# EAGLE design comando (EAGLE 6.5.0)
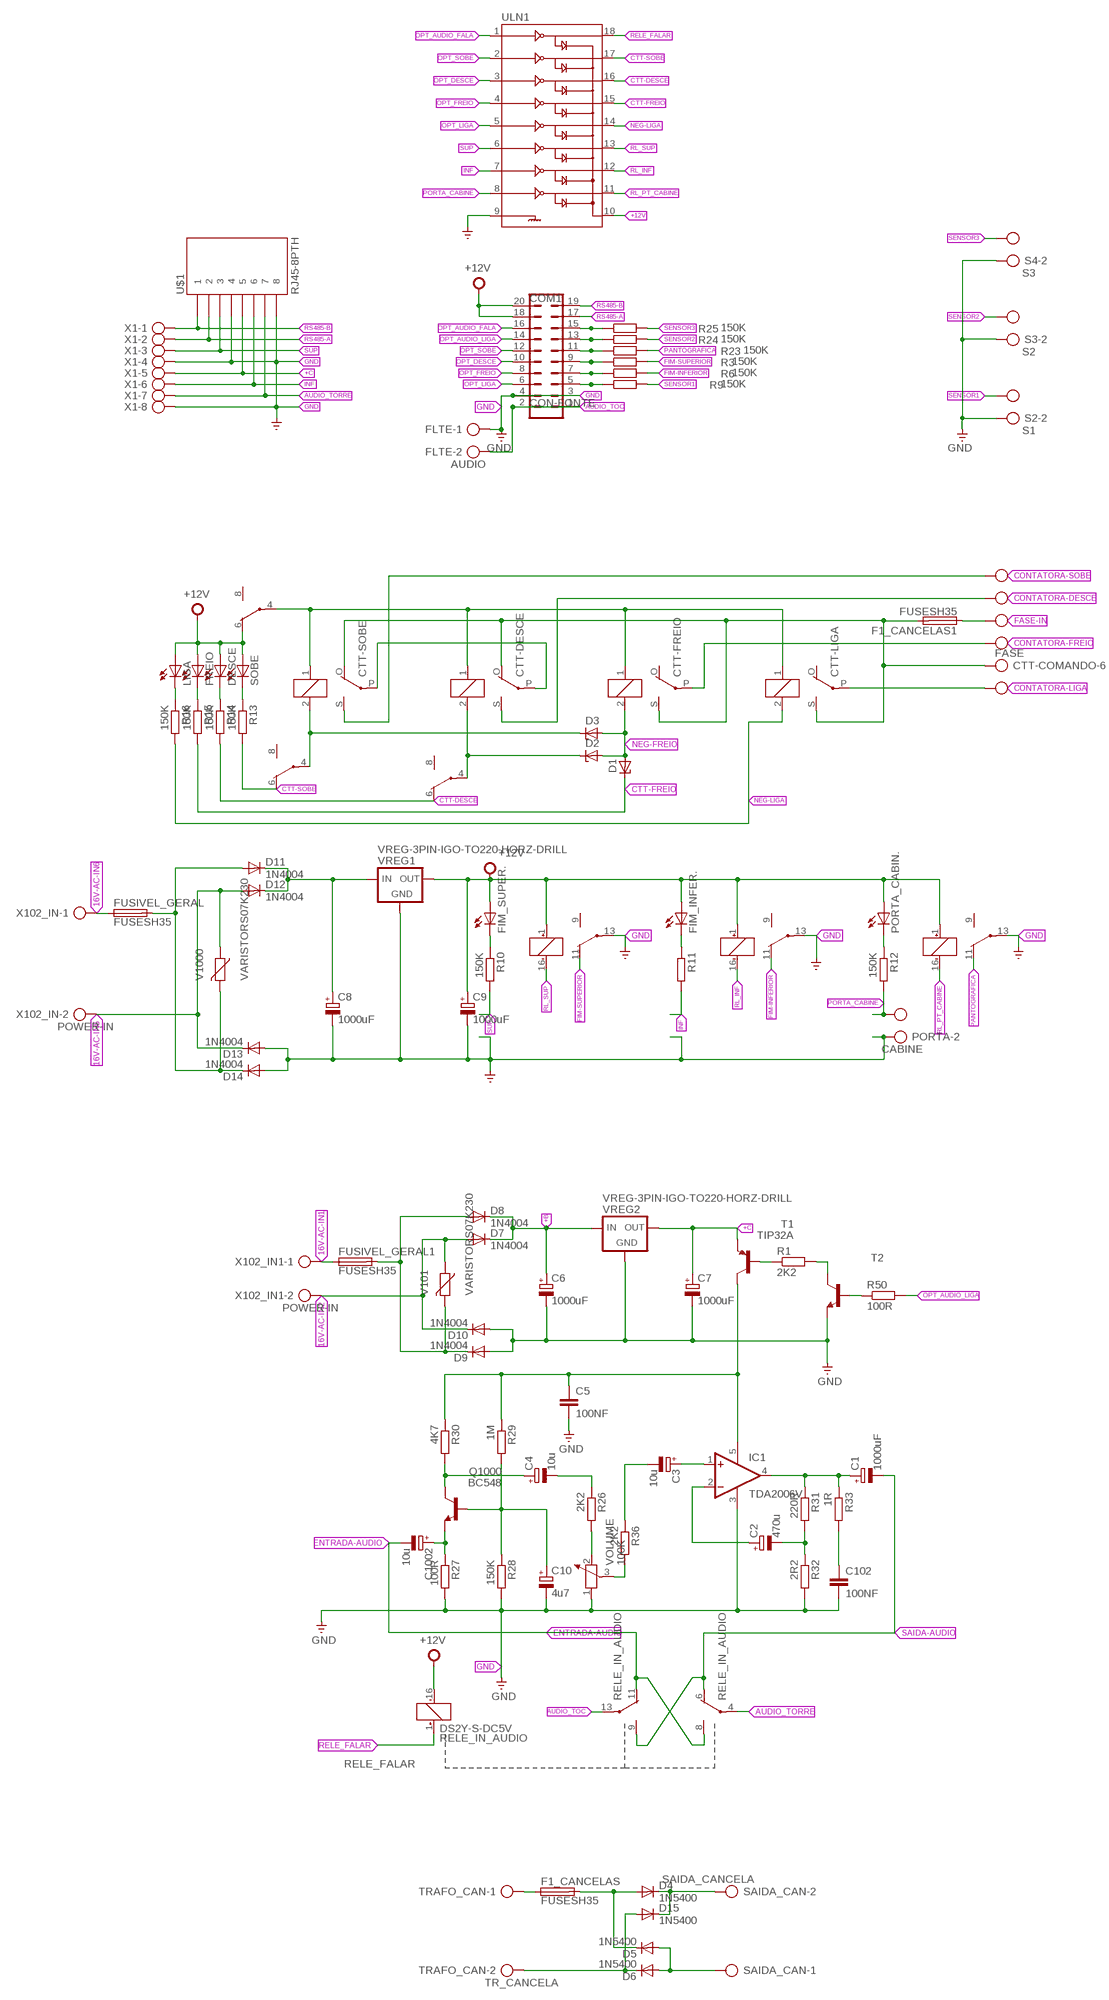
[diagram p0: schematic, sheet 1]

## Parts
C1  1000uF  CPOL-EUTAP5-80  [TAP5-80]
C2  470u  CPOL-EUTAP5-80  [TAP5-80]
C3  10u  CPOL-EUTAP5-45  [TAP5-45]
C4  10u  CPOL-EUTAP5-45  [TAP5-45]
C5  100NF  C-EU050-030X075  [C050-030X075]
C6  1000uF  CPOL-EUTAP5-80  [TAP5-80]
C7  1000uF  CPOL-EUTAP5-80  [TAP5-80]
C8  1000uF  CPOL-EUTAP5-80  [TAP5-80]
C9  1000uF  CPOL-EUTAP5-80  [TAP5-80]
C10  4u7  CPOL-EUTAP5-45  [TAP5-45]
C102  100NF  C-EU050-030X075  [C050-030X075]
C1002  10u  CPOL-EUTAP5-45  [TAP5-45]
COM1  CON-FONTE  ML20  [ML20]
CTT-COMANDO  FASE  AK500/6  [AK500/6]
CTT-DESCE  G5L  [G5LE]
CTT-FREIO  G5L  [G5LE]
CTT-LIGA  G5L  [G5LE]
CTT-SOBE  G5L  [G5LE]
D1  ZENER-DIODEZD-7.5  [ZDIO-7.5]
D2  ZENER-DIODEZD-7.5  [ZDIO-7.5]
D3  ZENER-DIODEZD-7.5  [ZDIO-7.5]
D4  1N5400  [DO201-15]
D5  1N5400  [DO201-15]
D6  1N5400  [DO201-15]
D7  1N4004  [DO41-10]
D8  1N4004  [DO41-10]
D9  1N4004  [DO41-10]
D10  1N4004  [DO41-10]
D11  1N4004  [DO41-10]
D12  1N4004  [DO41-10]
D13  1N4004  [DO41-10]
D14  1N4004  [DO41-10]
D15  1N5400  [DO201-15]
DESCE  LED5MM  [LED5MM]
F1_CANCELAS  FUSESH35  [SH25]
F1_CANCELAS1  FUSESH35  [SH25]
FIM_INFER.  LED5MM  [LED5MM]
FIM_SUPER.  LED5MM  [LED5MM]
FLTE  AUDIO  AK500/2  [AK500/2]
FREIO  LED5MM  [LED5MM]
FUSIVEL_GERAL  FUSESH35  [SH25]
FUSIVEL_GERAL1  FUSESH35  [SH25]
IC1  TDA2006V  [CB360]
LIGA  LED5MM  [LED5MM]
PORTA  CABINE  AK500/2  [AK500/2]
PORTA_CABIN.  LED5MM  [LED5MM]
PORTA_CABINE  DS2Y-S-DC5V  [DS2Y]
Q1000  BC548  [TO92-EBC]
R1  2K2  R-EU_0207/10  [0207/10]
R3  150K  R-EU_0207/10  [0207/10]
R6  150K  R-EU_0207/10  [0207/10]
R9  150K  R-EU_0207/10  [0207/10]
R10  150K  R-EU_0207/10  [0207/10]
R11  150K  R-EU_0207/10  [0207/10]
R12  150K  R-EU_0207/10  [0207/10]
R13  150K  R-EU_0207/10  [0207/10]
R14  150K  R-EU_0207/10  [0207/10]
R15  150K  R-EU_0207/10  [0207/10]
R16  150K  R-EU_0207/10  [0207/10]
R23  150K  R-EU_0207/10  [0207/10]
R24  150K  R-EU_0207/10  [0207/10]
R25  150K  R-EU_0207/10  [0207/10]
R26  2K2  R-EU_0207/10  [0207/10]
R27  100R  R-EU_0207/10  [0207/10]
R28  150K  R-EU_0207/10  [0207/10]
R29  1M  R-EU_0207/10  [0207/10]
R30  4K7  R-EU_0207/10  [0207/10]
R31  220R  R-EU_0207/10  [0207/10]
R32  2R2  R-EU_0207/10  [0207/10]
R33  1R  R-EU_0207/10  [0207/10]
R36  2K2  R-EU_0207/10  [0207/10]
R50  100R  R-EU_0207/10  [0207/10]
RELE_IN_AUDIO  DS2Y-S-DC5V  [DS2Y]
RL_FIM_INFERIOR  DS2Y-S-DC5V  [DS2Y]
RL_FIM_SUPERIOR  DS2Y-S-DC5V  [DS2Y]
S2  S1  AK500/2  [AK500/2]
S3  S2  AK500/2  [AK500/2]
S4  S3  AK500/2  [AK500/2]
SAIDA_CAN  SAIDA_CANCELA  AK500/2  [AK500/2]
SOBE  LED5MM  [LED5MM]
T1  TIP32A  [TO220]
T2  BC548-NPN-TO92-CBE  [TO92-CBE]
TRAFO_CAN  TR_CANCELA  AK500/2  [AK500/2]
U$1  RJ45-8PTH  [RJ45-8]
ULN1  ULN2803DIP  [DIL18]
V101  VARISTORS07K230  [S07K230]
V1000  VARISTORS07K230  [S07K230]
VOLUME  100K  POTENTIOMETER_PT-10  [PT-10]
VREG1  VREG-3PIN-IGO-TO220-HORZ-DRILL  [TO220-HORZ-DRILL]
VREG2  VREG-3PIN-IGO-TO220-HORZ-DRILL  [TO220-HORZ-DRILL]
X1  RS485_CNT  AK500/8  [AK500/8]
X102_IN  POWER-IN  AK500/2  [AK500/2]
X102_IN1  POWER-IN  AK500/2  [AK500/2]

## Nets
16V-AC-IN1 [power]: FUSIVEL_GERAL1.1 X102_IN1.1
16V-AC-IN2 [power]: D7.A D10.C V101.1 X102_IN1.2
16V-AC-IN5 [power]: D12.A D13.C V1000.1 X102_IN.2
16V-AC-IN6 [power]: FUSIVEL_GERAL.1 X102_IN.1
+12V [power]: C9.+ COM1.18 COM1.20 DESCE.A FIM_INFER..A FIM_SUPER..A FREIO.A LIGA.A PORTA_CABIN..A PORTA_CABINE.1(1:+) PORTA_CABINE.6(2:O) RELE_IN_AUDIO.16(1:-) RL_FIM_INFERIOR.1(1:+) RL_FIM_SUPERIOR.1(1:+) SOBE.A ULN1.10 VREG1.3(OUT)
+B [power]: C6.+ D7.C D8.C VREG2.1(IN)
+C [power]: C7.+ T1.3(E) U$1.5 VREG2.3(OUT) X1.5
AC-ALIM [AC]: CTT-COMANDO.6 CTT-DESCE.O(2:O) CTT-FREIO.S(2:S) CTT-LIGA.S(2:S) CTT-SOBE.O(2:O) F1_CANCELAS1.2
AUDIO_TOC [power]: COM1.1 COM1.2 FLTE.2 RELE_IN_AUDIO.13(3:P)
AUDIO_TORRE [power]: RELE_IN_AUDIO.4(2:P) U$1.7 X1.7
CONTATORA-DESCE [AC]: CTT-COMANDO.4 CTT-DESCE.S(2:S)
CONTATORA-FREIO [AC]: CTT-COMANDO.3 CTT-FREIO.P(2:P)
CONTATORA-LIGA [AC]: CTT-COMANDO.2 CTT-LIGA.P(2:P)
CONTATORA-SOBE [AC]: CTT-COMANDO.5 CTT-SOBE.S(2:S)
CTT-DESCE: R14.2 RL_FIM_INFERIOR.6(2:O) ULN1.16
CTT-FREIO: D1.C R15.2 ULN1.15
CTT-SOBE: R13.2 RL_FIM_SUPERIOR.6(2:O) ULN1.17
ENTRADA-AUDIO: C1002.- RELE_IN_AUDIO.8(2:S) RELE_IN_AUDIO.11(3:O)
FASE-IN [AC]: CTT-COMANDO.1 F1_CANCELAS1.1
FIM-INFERIOR: R6.2 RL_FIM_INFERIOR.11(3:O)
FIM-SUPERIOR: R3.2 RL_FIM_SUPERIOR.11(3:O)
GND [power]: C5.2 C6.- C7.- C8.- C9.- C10.- C102.2 COM1.3 COM1.4 D9.A D10.A D13.A D14.A FLTE.1 IC1.3(V-) PORTA.2 PORTA_CABINE.13(3:P) R27.2 R28.2 R32.2 RL_FIM_INFERIOR.13(3:P) RL_FIM_SUPERIOR.13(3:P) S2.2 S3.2 S4.2 T2.E U$1.4 U$1.8 ULN1.9 VOLUME.1 VREG1.2(GND) VREG2.2(GND) X1.4 X1.8
INF: R11.2 U$1.6 ULN1.7 X1.6
N$1 [AC]: D4.C D15.C SAIDA_CAN.2
N$2 [AC]: D4.A D5.C F1_CANCELAS.2
N$3 [AC]: D6.C D15.A TRAFO_CAN.2
N$4 [AC]: D5.A D6.A SAIDA_CAN.1
N$5 [power]: CTT-DESCE.1 CTT-FREIO.1 CTT-LIGA.1 CTT-SOBE.1 PORTA_CABINE.4(2:P)
N$6: R36.2 VOLUME.3
N$7 [power]: C8.+ D11.C D12.C VREG1.1(IN)
N$10: FIM_SUPER..K(C) R10.1
N$11: R26.2 VOLUME.2
N$19: FIM_INFER..K(C) R11.1
N$21: R1.1 T1.1(B)
N$24: PORTA_CABIN..K(C) R12.1
N$28: R13.1 SOBE.K(C)
N$29: DESCE.K(C) R14.1
N$32: FREIO.K(C) R15.1
N$33: LIGA.K(C) R16.1
N$39: R50.1 T2.B
N$78 [AC]: F1_CANCELAS.1 TRAFO_CAN.1
N$79 [power]: C1.+ IC1.4(OUT) R31.1 R33.1
N$80: C4.- R26.1
N$89: C4.+ Q1000.C R30.2
N$90: C10.+ Q1000.B R28.1 R29.2
N$92: C1002.+ Q1000.E R27.1
N$94: C3.- R36.1
N$104 [power]: C5.1 IC1.5(V+) R29.1 R30.1 T1.2(C)
N$105: C3.+ IC1.1(+IN)
N$106 [power]: C2.- R31.2 R32.1
N$119 [power]: C2.+ IC1.2(-IN)
N$120: C102.1 R33.2
NEG-DESCE: CTT-DESCE.2 D2.C RL_FIM_INFERIOR.4(2:P)
NEG-FREIO: CTT-FREIO.2 D1.A D2.A D3.A
NEG-LIGA: CTT-LIGA.2 R16.2 ULN1.14
NEG-SOB: CTT-SOBE.2 D3.C RL_FIM_SUPERIOR.4(2:P)
OPT_AUDIO_FALA: COM1.16 ULN1.1
OPT_AUDIO_LIGA: COM1.14 R50.2
OPT_DESCE: COM1.10 ULN1.3
OPT_FIM_INFERIOR: COM1.7 R6.1
OPT_FIM_SUPERIOR: COM1.9 R3.1
OPT_FREIO: COM1.8 ULN1.4
OPT_LIGA: COM1.6 ULN1.5
OPT_PANTOGRAFICA: COM1.11 R23.1
OPT_SENSOR1: COM1.5 R9.1
OPT_SENSOR2: COM1.13 R24.1
OPT_SENSOR3: COM1.15 R25.1
OPT_SOBE: COM1.12 ULN1.2
PANTOGRAFICA: PORTA_CABINE.11(3:O) R23.2
PORTA_CABINE: PORTA.1 R12.2 ULN1.8
RELE_FALAR: RELE_IN_AUDIO.1(1:+) ULN1.18
RELE_LIGA_AUDIO: R1.2 T2.C
RL_INF: RL_FIM_INFERIOR.16(1:-) ULN1.12
RL_PT_CABINE: PORTA_CABINE.16(1:-) ULN1.11
RL_SUP: RL_FIM_SUPERIOR.16(1:-) ULN1.13
RS485-A: COM1.17 U$1.2 X1.2
RS485-B: COM1.19 U$1.1 X1.1
SAIDA-AUDIO [power]: C1.- RELE_IN_AUDIO.6(2:O) RELE_IN_AUDIO.9(3:S)
SAIDA_FUSIVEL [power]: D11.A D14.C FUSIVEL_GERAL.2 V1000.2
SAIDA_FUSIVEL1 [power]: D8.A D9.C FUSIVEL_GERAL1.2 V101.2
SENSOR1: R9.2 S2.1
SENSOR2: R24.2 S3.1
SENSOR3: R25.2 S4.1
SOB-DESC-PROT [AC]: CTT-DESCE.P(2:P) CTT-SOBE.P(2:P)
SUP: R10.2 U$1.3 ULN1.6 X1.3
Unconnected: CTT-FREIO.O(2:O) CTT-LIGA.O(2:O) PORTA_CABINE.8(2:S) PORTA_CABINE.9(3:S) RL_FIM_INFERIOR.8(2:S) RL_FIM_INFERIOR.9(3:S) RL_FIM_SUPERIOR.8(2:S) RL_FIM_SUPERIOR.9(3:S)

## Library data of the parts
C1-C4 C6-C10 C1002 = rcl:CPOL-EU: POLARIZED CAPACITOR, European symbol
C5 C102 = rcl:C-EU: CAPACITOR, European symbol
COM1 = con-ml:ML20: HARTING; OC_FARNELL: unknown; OC_NEWARK: unknown
CTT-COMANDO = con-ptr500:AK500/6: CONNECTOR; OC_FARNELL: unknown; OC_NEWARK: unknown
CTT-DESCE CTT-FREIO CTT-LIGA CTT-SOBE = relay:G5L: RELAY 1 x switch, 10 A/120 V AC, 8 A/30 V ADC, Omron; OC_FARNELL: unknown; OC_NEWARK: unknown
D1-D3 = diode:ZENER-DIODE: Z-Diode
D4-D6 D15 = diode:1N5400: DIODE standard rectifier, 3 A, 50 V (Motorola)
D7-D14 = diode:1N4004: DIODE general purpose rectifier, 1 A
DESCE FIM_INFER. FIM_SUPER. FREIO LIGA PORTA_CABIN. SOBE = led:LED: LED OSRAM: - CHIPLED LG R971, LG N971, LY N971, LG Q971, LY Q971, LO R971, LY R971 LH N974, LH R974 LS Q976, LO Q976, LY Q976 LO Q996 - Hyper CHIPLED LW Q18S LB Q993, LB Q99A, LB R99A - SideLED LS A670, LO A670, LY A670, LG A670, LP A670 LB A673, LV A673, LT A673, LW A673 LH A674 LY A675 LS A676, LA A676, LO A676, LY A676, LW A676 LS A679, LY A679, LG A679 - Hyper Micro SIDELED® LS Y876, LA Y876, LO Y876, LY Y876 LT Y87S - SmartLED LW L88C, LW L88S LB L89C, LB L89S, LG L890 LS L89K, LO L89K, LY L89K LS L896, LA L896, LO L896, LY L896 - TOPLED LS T670, LO T670, LY T670, LG T670, LP T670 LSG T670, LSP T670, LSY T670, LOP T670, LYG T670 LG T671, LOG T671, LSG T671 LB T673, LV T673, LT T673, LW T673 LH T674 LS T676, LA T676, LO T676, LY T676, LB T676, LH T676, LSB T676, LW T676 LB T67C, LV T67C, LT T67C, LS T67K, LO T67K, LY T67K, LW E67C LS E67B, LA E67B, LO E67B, LY E67B, LB E67C, LV E67C, LT E67C LW T67C LS T679, LY T679, LG T679 LS T770, LO T770, LY T770, LG T770, LP T770 LB T773, LV T773, LT T773, LW T773 LH T774 LS E675, LA E675, LY E675, LS T675 LS T776, LA T776, LO T776, LY T776, LB T776 LHGB T686 LT T68C, LB T68C - Hyper Mini TOPLED® LB M676 - Mini TOPLED Santana® LG M470 LS M47K, LO M47K, LY M47K Source: http://www.osram.convergy.de LUXEON: - LUMILED® LXK2-PW12-R00, LXK2-PW12-S00, LXK2-PW14-U00, LXK2-PW14-V00 LXK2-PM12-R00, LXK2-PM12-S00, LXK2-PM14-U00 LXK2-PE12-Q00, LXK2-PE12-R00, LXK2-PE12-S00, LXK2-PE14-T00, LXK2-PE14-U00 LXK2-PB12-K00, LXK2-PB12-L00, LXK2-PB12-M00, LXK2-PB14-N00, LXK2-PB14-P00, LXK2-PB14-Q00 LXK2-PR12-L00, LXK2-PR12-M00, LXK2-PR14-Q00, LXK2-PR14-R00 LXK2-PD12-Q00, LXK2-PD12-R00, LXK2-PD12-S00 LXK2-PH12-R00, LXK2-PH12-S00 LXK2-PL12-P00, LXK2-PL12-Q00, LXK2-PL12-R00 Source: www.luxeon.com KINGBRIGHT: KA-3528ASYC Source: www.kingbright.com
F1_CANCELAS F1_CANCELAS1 FUSIVEL_GERAL FUSIVEL_GERAL1 = fuse:FUSE: Fuse; OC_FARNELL: unknown; OC_NEWARK: unknown
FLTE PORTA S2-S4 SAIDA_CAN TRAFO_CAN X102_IN X102_IN1 = con-ptr500:AK500/2: CONNECTOR; OC_FARNELL: unknown; OC_NEWARK: unknown
IC1 = linear:TDA2006: AUDIO AMPLIFIER
PORTA_CABINE RELE_IN_AUDIO RL_FIM_INFERIOR RL_FIM_SUPERIOR = relay:DS2Y-S-DC*: MINIATURE RELAY NAiS Source: http://www.mew-europe.com/.. en_ds_61005_0023.pdf; MPN: DS2Y-S-DC5V; OC_FARNELL: unknown; OC_NEWARK: 13P3268
Q1000 = transistor-npn:BC548*: NPN Transistor
R1 R3 R6 R9-R16 R23-R33 R36 R50 = rcl:R-EU_: RESISTOR, European symbol
T1 = transistor:TIP32: PNP Transistor Medium Power Linear Switching Applications Source: http://onsemi.com
T2 = transistor:*-NPN-: NPN Transistror BF959 corrected 2008.03.06
U$1 = SparkFun-Connectors:RJ45-8: RJ45 Jack Simple RJ45, 8-pin connection - connector for common Cat5, Cat5e, and Cat6 Ethernet cables. Footprint not yet proven in production. Connector sku is PRT-00643; Breakout PCB sku is BOB-00716.
ULN1 = SparkFun:ULN2803: Darlington Driver ULN2803 Darlington array. 500mA max per channel, 8-channel package. Spark Fun Electronics SKU : COM-00312
V101 V1000 = varistor:VARISTOR: VARISTOR
VOLUME = rcl:POTENTIOMETER_: Potentiometer
VREG1 VREG2 = tidyeagle:VREG-3PIN: Generic 3 Pin Voltage Regulator For voltage regulators such as the LM7805 and similar. Horizontal TO220 packages are available with and without drill holes for mounting. Important: Note the pin connection and check against your datasheet. Pin 1 is the left most pin when looking down from the top of the package, as shown in the diagram on the right hand side. IGO (e.g. LM7805) Pin 1 - Input Pin 2 - GND Pin 3 - Output GOI (e.g. LD1086V33) Pin 1 - GND Pin 2 - Output Pin 3 - Input
X1 = con-ptr500:AK500/8: CONNECTOR; OC_FARNELL: unknown; OC_NEWARK: unknown

## Net classes
0 default: drill 0.203 mm, clearance 0.203 mm
1 AC: width 2.032 mm, drill 0.203 mm, clearance 0.203 mm
2 power: width 0.762 mm, drill 0.203 mm, clearance 0.203 mm

## Board
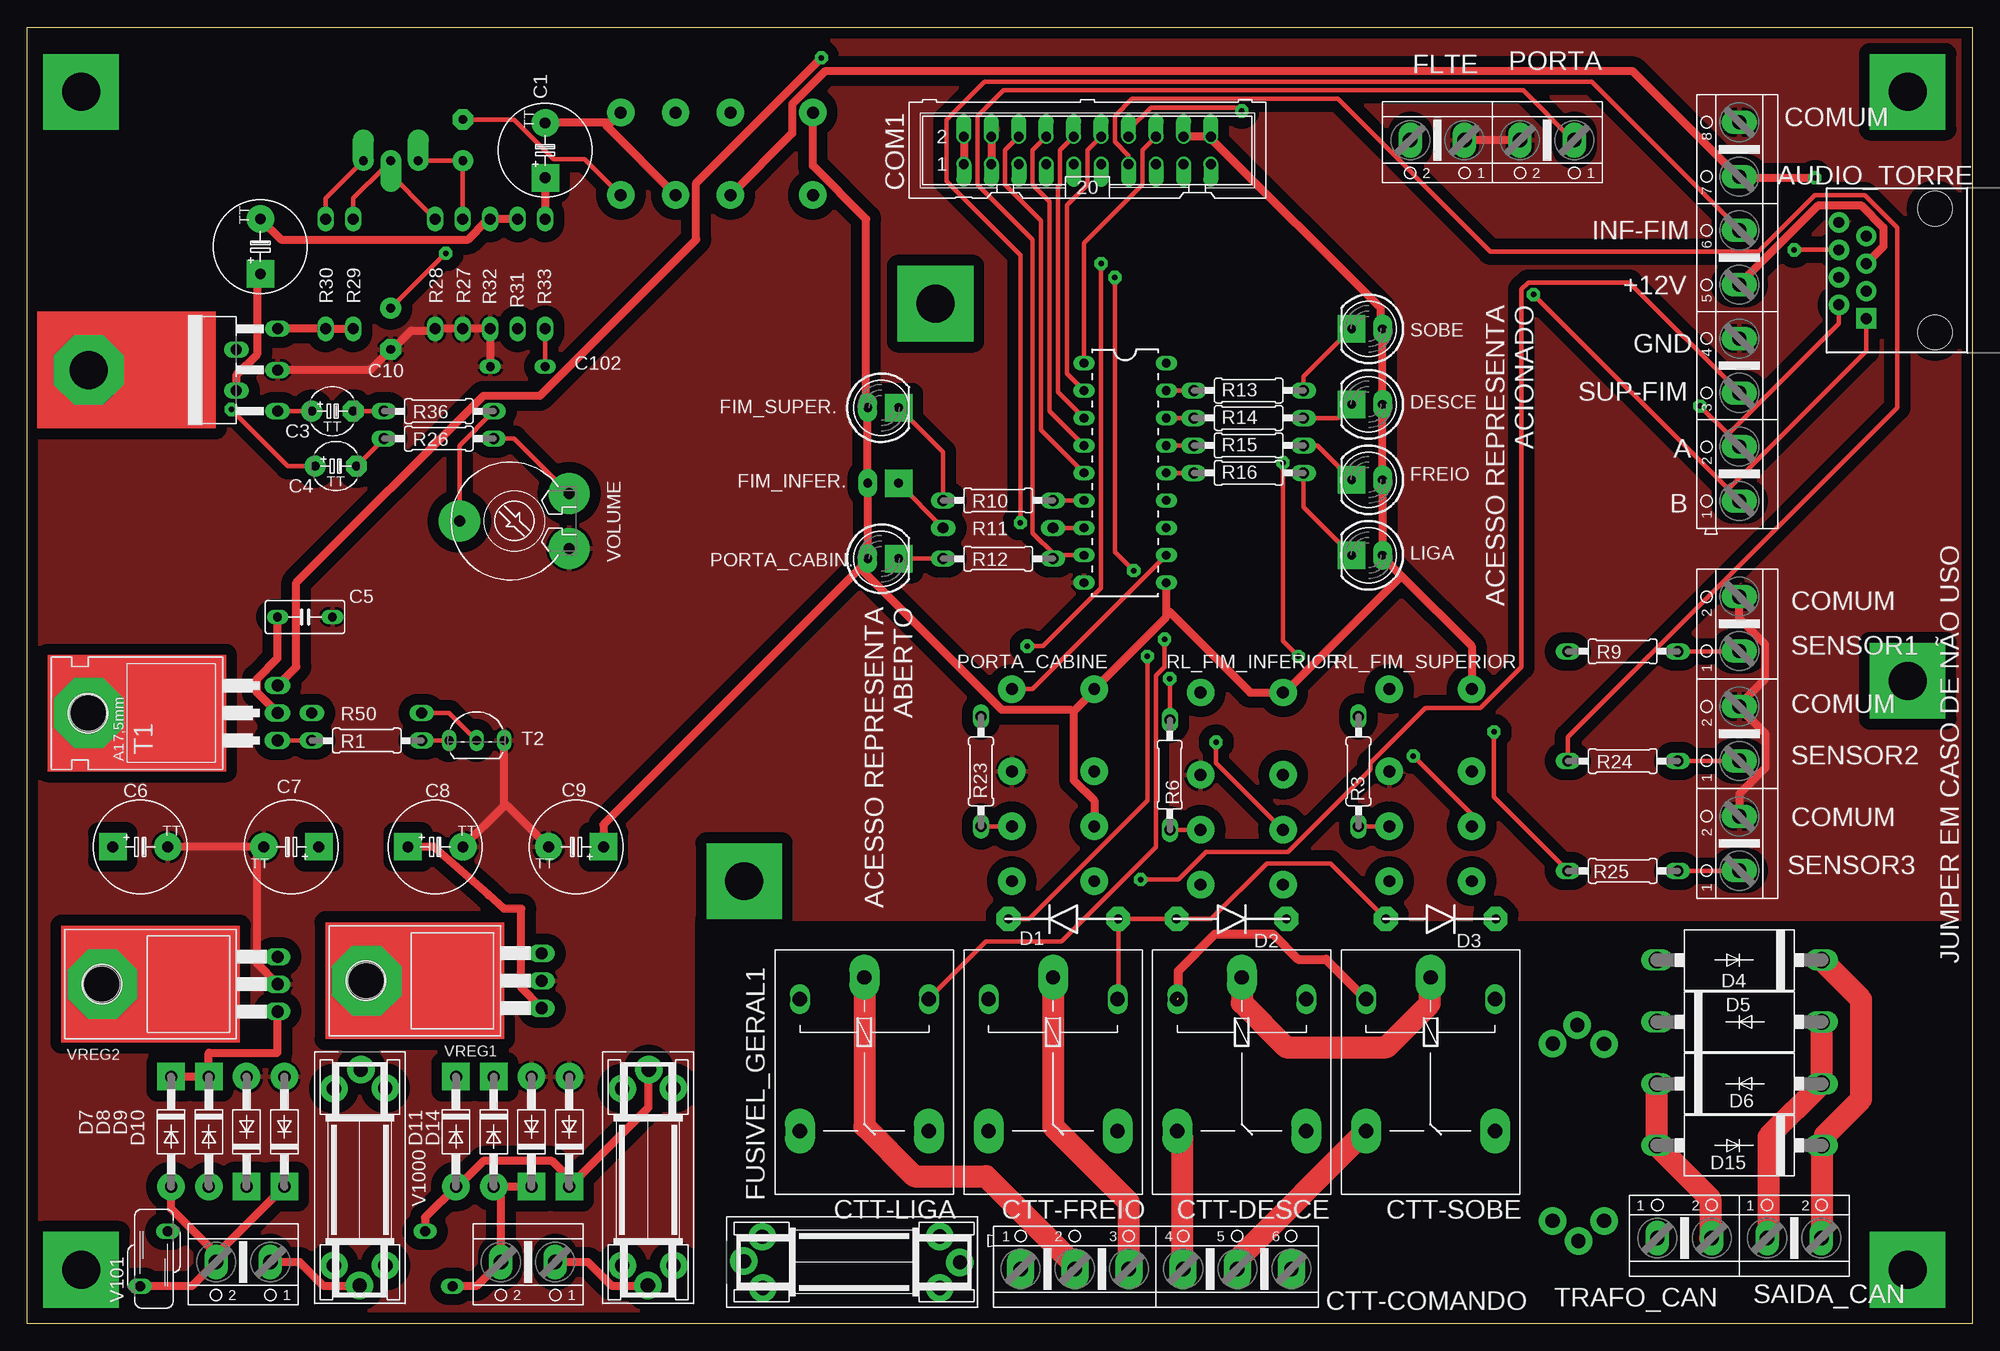
[diagram p1: board, top side]
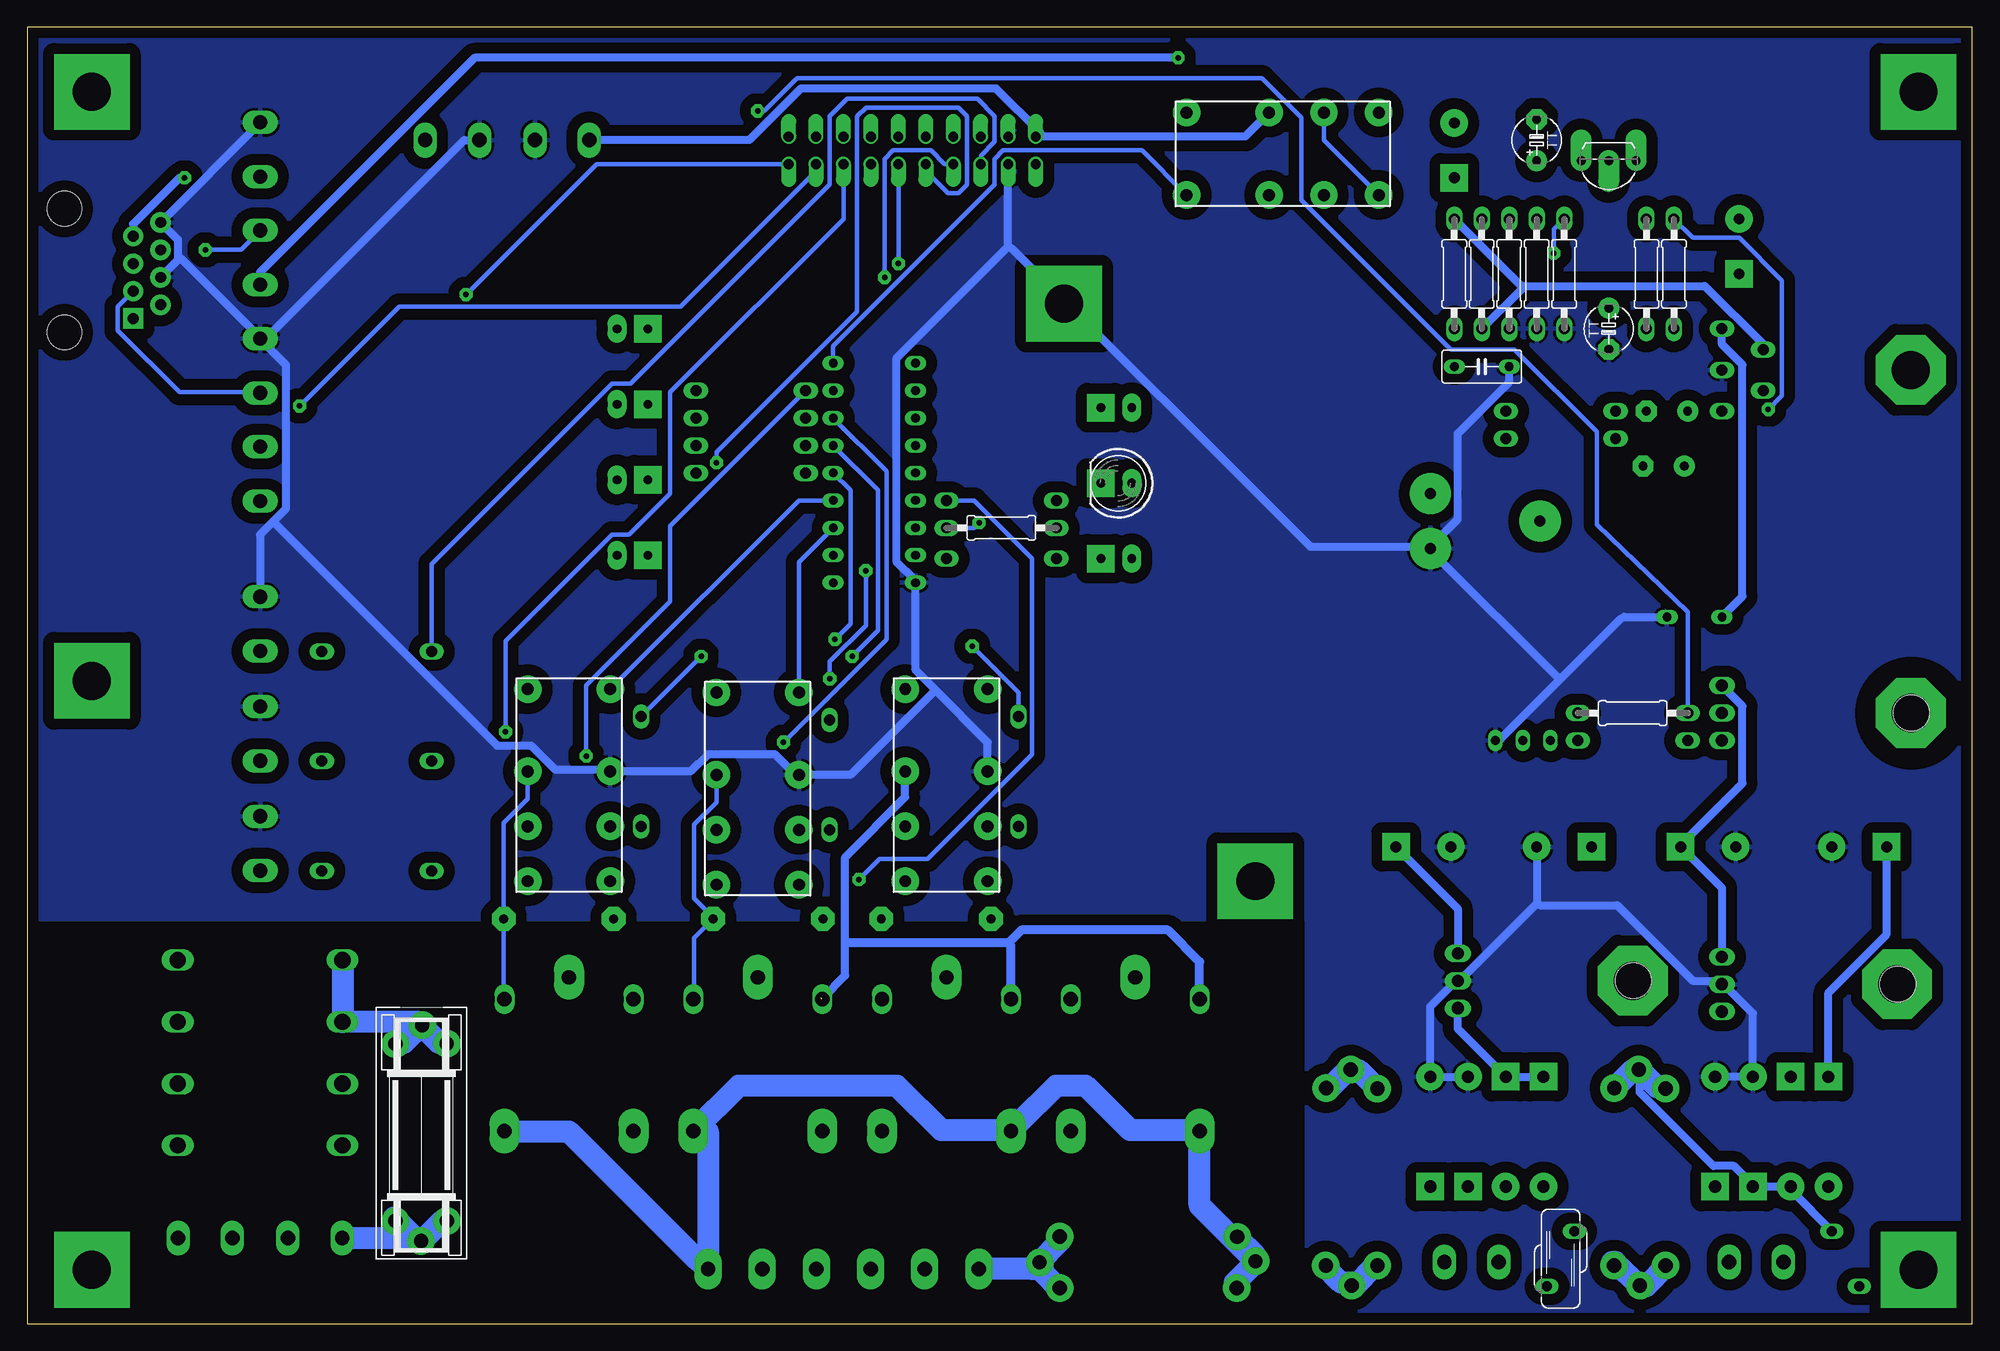
[diagram p2: board, bottom side, seen from below]

Size 180 x 120 mm. Coordinates in mm from the lower left corner, seen from the top.
Outline: 0,0 0,120 180,120 180,0 0,0
Copper layers (1*16): Top 0.035mm / dielectric 1.5mm / Bottom 0.035mm
Design rules "placa35": minimum track width 16mil, minimum drill 20mil, track to track 10mil, track to pad 10mil, pad to pad 10mil, via to via 10mil, smd to smd 10mil, copper to edge 20mil, drill to drill 10mil, minimum pad ring 10mil, minimum via ring 14mil, stop-mask expansion 4mil, vias tented up to drill 0mil, thermal gap 10mil

### Footprints (pad centres in the part's own frame; a part is rotated, then mirrored left to right if it is on the bottom)
TAP5-80 = drill 1 pad 2.54 square: + -2.54,0 | drill 1 pad 2.54: - 2.54,0
TAP5-45 = drill 0.813 pad 1.93: + -1.905,0 | drill 0.813 pad 1.93 octagon: - 1.905,0
C050-030X075 = drill 0.813 pad 1.27 long: 1 -2.54,0; 2 2.54,0
ML20 = drill 0.9 pad 1.016 offset: 1 -11.43,-1.27; 2 -11.43,1.27; 3 -8.89,-1.27; 4 -8.89,1.27; 5 -6.35,-1.27; 6 -6.35,1.27; 7 -3.81,-1.27; 8 -3.81,1.27; 9 -1.27,-1.27; 10 -1.27,1.27; 11 1.27,-1.27; 12 1.27,1.27; 13 3.81,-1.27; 14 3.81,1.27; 15 6.35,-1.27; 16 6.35,1.27; 17 8.89,-1.27; 18 8.89,1.27; 19 11.43,-1.27; 20 11.43,1.27
AK500/6 = drill 1.321 pad 2.54 long: 1 -12.522,0; 2 -7.518,0; 3 -2.515,0; 4 2.515,0; 5 7.518,0; 6 12.522,0
G5LE = drill 1.321 long: 1 -7.493,-5.969; 2 -7.493,5.969 | drill 1.321 pad 2.794 long: O 4.699,5.969; P -9.525,0; S 4.699,-5.969
ZDIO-7.5 = drill 0.813 pad 2.184 octagon: A 5.08,0; C -5.08,0
DO201-15 = drill 1.499 long: A 7.62,0; C -7.62,0
DO41-10 = drill 1.118 pad 2.54: A 5.08,0 | drill 1.118 pad 2.54 square: C -5.08,0
LED5MM = drill 0.813 pad 1.778 long: A -1.27,0 | drill 0.813 pad 2.54 square: K 1.587,0
SH25 = drill 1.321 pad 2.54: 1 -9.802,0.028; 2 10.18,-0.077; 4 -7.938,2.4; 5 -7.938,-2.362; 6 8.435,2.402; 7 8.475,-2.34
AK500/2 = drill 1.321 pad 2.184 long: 1 -2.515,0; 2 2.515,0
CB360 = drill 1.016 long: 1 -3.81,-8.255; 2 -1.905,-4.445; 3 0,-8.255; 4 1.905,-4.445; 5 3.81,-8.255
DS2Y = drill 1.1 pad 2.54: 1 -8.89,-3.81; 4 -1.27,-3.81; 6 3.81,-3.81; 8 8.89,-3.81; 9 8.89,3.81; 11 3.81,3.81; 13 -1.27,3.81; 16 -8.89,3.81
TO92-EBC = drill 0.813 pad 1.93 offset: B 0,-1.27; C -2.54,-1.27; E 2.54,-1.27
0207/10 = drill 1.016 pad 1.422 long: 1 -5.08,0; 2 5.08,0
TO220 = drill 1.118 long: 1 -2.54,-6.35; 2 0,-6.35; 3 2.54,-6.35 | hole 3.302: 0,11.176
TO92-CBE = drill 0.813 long: B 0,0; C -2.54,0; E 2.54,0
RJ45-8 = drill 1 pad 1.88 square: 1 -4.445,6.35 | drill 1 pad 1.88: 2 -3.175,8.89; 3 -1.905,6.35; 4 -0.635,8.89; 5 0.635,6.35; 6 1.905,8.89; 7 3.175,6.35; 8 4.445,8.89 | hole 3.2: -5.715,0; 5.715,0
DIL18 = drill 0.813 long: 1 -10.16,-3.81; 2 -7.62,-3.81; 3 -5.08,-3.81; 4 -2.54,-3.81; 5 0,-3.81; 6 2.54,-3.81; 7 5.08,-3.81; 8 7.62,-3.81; 9 10.16,-3.81; 10 10.16,3.81; 11 7.62,3.81; 12 5.08,3.81; 13 2.54,3.81; 14 0,3.81; 15 -2.54,3.81; 16 -5.08,3.81; 17 -7.62,3.81; 18 -10.16,3.81
S07K230 = drill 0.914 long: 1 -1.27,-2.54; 2 1.27,2.54
PT-10 = drill 1.016 pad 3.81: 1 -2.54,-5.08; 2 2.54,-5.08; 3 0,5.08
TO220-HORZ-DRILL = drill 1.118 long: 1 -2.54,-8.89; 2 0,-8.89; 3 2.54,-8.89 | hole 3.302: 0,7.366
AK500/8 = drill 1.321 pad 2.184 long: 1 -17.526,0; 2 -12.497,0; 3 -7.518,0; 4 -2.489,0; 5 2.489,0; 6 7.518,0; 7 12.497,0; 8 17.526,0

### Placement (x,y rotation side)
C1  47.94,108.58 90 top
C2  21.59,99.69 90 top
C3  28.26,84.45 0 top
C4  28.57,79.38 0 top
C5  25.72,65.41 0 top
C6  10.48,44.13 0 top
C7  24.45,44.13 180 top
C8  37.78,44.13 0 top
C9  50.8,44.13 180 top
C10  33.66,92.08 270 bottom
C102  45.4,88.58 0 bottom
C1002  40.32,109.54 90 bottom
COM1  98.11,108.58 0 top
CTT-COMANDO  104.46,5.08 0 top
CTT-DESCE  112.39,22.54 270 top
CTT-FREIO  94.93,22.54 270 top
CTT-LIGA  77.47,22.54 270 top
CTT-SOBE  129.86,22.54 270 top
D1  95.89,37.47 0 top
D2  111.44,37.47 180 top
D3  130.81,37.47 180 top
D4  158.43,33.66 180 top
D5  158.43,27.94 0 top
D6  158.43,22.23 0 top
D7  13.34,17.78 270 top
D8  16.83,17.78 270 top
D9  20.32,17.78 90 top
D10  23.81,17.78 90 top
D11  39.69,17.78 270 top
D12  43.18,17.78 270 top
D13  46.67,17.78 90 top
D14  50.16,17.78 90 top
D15  158.43,16.51 180 top
DESCE  124.14,85.09 180 top
F1_CANCELAS  143.51,17.46 90 bottom
F1_CANCELAS1  76.52,5.71 180 top
FIM_INFER.  79.06,77.79 180 bottom
FIM_SUPER.  79.06,84.77 0 top
FLTE  130.49,109.54 180 top
FREIO  124.14,78.11 180 top
FUSIVEL_GERAL  57.47,13.34 90 top
FUSIVEL_GERAL1  30.8,13.34 90 top
IC1  14.92,88.27 90 top
LIGA  124.14,71.12 180 top
PORTA  140.65,109.54 180 top
PORTA_CABIN.  79.06,70.8 0 top
PORTA_CABINE  94.93,49.85 270 bottom
Q1000  33.66,106.36 180 bottom
R1  31.43,53.98 0 top
R3  123.19,51.12 270 top
R6  105.73,50.8 270 top
R9  147.64,62.23 0 top
R10  89.85,76.2 0 top
R11  89.85,73.66 180 bottom
R12  89.85,70.8 0 top
R13  113.03,86.36 180 top
R14  113.03,83.82 180 top
R15  113.03,81.28 180 top
R16  113.03,78.74 180 top
R23  88.27,51.12 270 top
R24  147.64,52.07 0 top
R25  147.64,41.91 0 top
R26  38.1,81.92 0 top
R27  40.32,97.16 270 bottom
R28  37.78,97.16 270 bottom
R29  30.16,97.16 90 bottom
R30  27.62,97.16 90 bottom
R31  45.4,97.16 90 bottom
R32  42.86,97.16 270 bottom
R33  47.94,97.16 270 bottom
R36  38.1,84.45 0 top
R50  31.43,56.52 0 bottom
RELE_IN_AUDIO  63.82,108.27 0 bottom
RL_FIM_INFERIOR  112.39,49.53 270 bottom
RL_FIM_SUPERIOR  129.86,49.85 270 bottom
S2  158.43,64.77 90 top
S3  158.43,54.61 90 top
S4  158.43,44.45 90 top
SAIDA_CAN  163.51,7.94 0 top
SOBE  124.14,92.08 180 top
T1  16.83,56.52 90 top
T2  41.59,53.98 0 top
TRAFO_CAN  153.35,7.94 0 top
U$1  176.53,97.47 90 top
ULN1  101.6,78.74 270 top
V101  11.75,6.03 0 top
V1000  38.1,6.03 0 bottom
VOLUME  45.09,74.3 90 top
VREG1  38.73,31.75 90 top
VREG2  14.29,31.43 90 top
X1  158.43,93.66 90 top
X102_IN  46.35,5.71 180 top
X102_IN1  20,5.71 180 top

### Tracks (layer width: path | path; a pad name or v marks a point on that pad's centre or on a via)
16V-AC-IN1
  Top 0.762: X102_IN1.1 25.24,5.71 27.46,3.49 30.64,3.49 FUSIVEL_GERAL1.1
16V-AC-IN2
  Top 0.762: V101.1 15.24,3.49 17.46,5.71 X102_IN1.2 | D7.A 13.34,10.64 17.3,6.67 17.3,6.03 X102_IN1.2 | D10.C 17.62,6.51 X102_IN1.2
16V-AC-IN5
  Top 0.762: V1000.1 41.59,3.49 43.81,5.71 X102_IN.2 43.81,6.03 43.81,12.38 D12.A D13.C
16V-AC-IN6
  Top 0.762: X102_IN.1 51.91,5.71 54.13,3.49 57.31,3.49 FUSIVEL_GERAL.1
+12V
  Top 0.762: 105.41,65.88 105.41,65.41 PORTA_CABINE.1 98.58,58.42 96.84,56.67 | 105.41,65.88 ULN1.10 | PORTA_CABINE.6 98.74,48.42 96.84,50.32 96.84,56.67 | 105.41,65.88 105.73,65.88 113.19,58.42 RL_FIM_INFERIOR.1 116.52,58.58 127.16,69.22 | COM1.18 COM1.20 109.7,109.54 125.25,93.98 125.25,92.39 SOBE.A DESCE.A FREIO.A LIGA.A 125.57,70.8 127.16,69.22 | RL_FIM_SUPERIOR.1 133.67,62.71 127.16,69.22 | PORTA_CABIN..A FIM_INFER..A FIM_SUPER..A 77.63,85.09 77.63,102.23 72.71,107.16 RELE_IN_AUDIO.16 | C9.+ 53.34,46.2 77.63,70.48 PORTA_CABIN..A | 96.84,56.67 96.52,56.83 90.17,56.83 77.31,69.69 PORTA_CABIN..A
  Bottom 0.762: VREG1.3 47.62,38.42 C9.+
+B
  Top 0.762: VREG2.1 23.18,25.08 16.83,25.08 D8.C D7.C
  Bottom 0.762: C6.+ 7.94,36.04 13.34,30.64 D7.C
+C  (via drill 0.51)
  Top 0.762: U$1.5 171.77,99.69 171.77,101.44 169.7,103.5 165.74,103.5 158.43,96.2 X1.5 | v73.5,117.16 61.91,105.57 61.91,100.33 47.47,85.88 42.23,85.88 24.92,68.58 24.92,60.8 T1.3
  Bottom 0.762: VREG2.3 23.18,40.32 C7.+ 26.83,44.45 21.27,50.01 21.27,57.15 T1.3 | X1.5 158.43,97.31 138.59,117.16 v73.5,117.16
AC-ALIM
  Top 2.032: 71.6,17.94 CTT-LIGA.S | 88.9,17.94 CTT-FREIO.S
  Bottom 2.032: 72.39,17.94 77.95,17.94 82.07,22.07 84.77,22.07 88.34,18.49 | 72.39,17.94 71.6,17.94 | 88.9,17.94 88.34,18.49 | F1_CANCELAS1.2 71.5,10.96 CTT-LIGA.S 72.39,17.94 | 88.34,18.49 88.74,18.89 CTT-FREIO.S 89.06,17.94 95.41,17.94 99.54,22.07 114.14,22.07 CTT-DESCE.O 117,17.78 117,5.08 CTT-COMANDO.6 117.95,5.87 129.86,17.78 135.73,17.78 CTT-SOBE.O
AUDIO_TOC
  Top 0.762: COM1.2 COM1.1
  Bottom 0.762: RELE_IN_AUDIO.13 67.31,109.86 COM1.2 86.2,110.17 90.33,114.3 108.43,114.3 113.19,109.54 FLTE.2
AUDIO_TORRE  (via drill 0.51)
  Top 0.762: v165.42,106.05 158.43,106.05 X1.7 158.12,106.36 148.59,115.89 73.82,115.89 70.8,112.87 70.8,110.17 RELE_IN_AUDIO.4
  Bottom 0.762: U$1.7 170.18,101.76 165.89,106.05 v165.42,106.05
CONTATORA-DESCE
  Top 2.032: CTT-COMANDO.4 106.84,5.08 106.84,17.46 106.52,17.78 CTT-DESCE.S
CONTATORA-FREIO
  Top 2.032: CTT-FREIO.P 94.93,18.26 101.92,11.27 101.92,5.08 CTT-COMANDO.3
CONTATORA-LIGA
  Top 2.032: CTT-LIGA.P 77.47,18.26 82.07,13.65 88.74,13.65 96.84,5.56 97,5.08 CTT-COMANDO.2
  Bottom 2.032: 96.84,5.56 96.84,5.08 CTT-COMANDO.2
CONTATORA-SOBE
  Top 2.032: CTT-SOBE.S 112.08,6.03 112.08,5.08 CTT-COMANDO.5
CTT-DESCE  (via drill 0.51)
  Top 0.406: R14.2 ULN1.16 | v110.01,53.82 110.01,51.91 RL_FIM_INFERIOR.6
  Bottom 0.406: ULN1.16 100.49,78.9 100.49,63.34 v110.01,53.82
CTT-FREIO  (via drill 0.51)
  Top 0.406: R15.2 ULN1.15 | v103.66,61.75 103.66,48.42 92.71,37.47 D1.C
  Bottom 0.406: ULN1.15 101.28,77.15 101.28,64.14 v103.66,61.75
CTT-SOBE  (via drill 0.51)
  Top 0.406: R13.2 ULN1.17 | v128.27,52.55 133.67,47.15 RL_FIM_SUPERIOR.6
  Bottom 0.406: R13.2 120.49,73.82 120.49,66.83 128.27,59.05 v128.27,52.55
ENTRADA-AUDIO
  Top 0.406: C1002.- 45.09,111.44 48.74,107.79 51.59,107.79 RELE_IN_AUDIO.8
  Bottom 0.406: RELE_IN_AUDIO.11 60.01,109.54 RELE_IN_AUDIO.8
FASE-IN
  Bottom 2.032: F1_CANCELAS1.1 86.93,5.08 CTT-COMANDO.1
FIM-INFERIOR
  Top 0.406: RL_FIM_INFERIOR.11 R6.2
FIM-SUPERIOR
  Top 0.406: RL_FIM_SUPERIOR.11 R3.2
GND
  Top 0.762: C6.- C7.- 21.27,43.81 21.27,33.34 VREG2.2 | C102.2 R32.2 R27.2 R28.2 37.47,91.92 35.56,91.92 33.97,90.33 C10.- 31.75,88.27 IC1.3 | 44.13,47.94 T2.E | C8.- 44.13,47.94 | C9.- 44.45,47.94 44.13,47.94 | COM1.4 COM1.3 | S4.2 158.43,49.05 160.81,51.44 160.81,54.61 158.43,56.99 S3.2 158.59,57.47 160.81,59.69 160.81,62.87 158.43,65.25 S2.2 | PORTA.2 FLTE.1
  Bottom 0.762: VREG2.2 22.86,31.27 20.32,28.73 D9.A D10.A | D13.A D14.A 50.16,29.37 47.94,31.59 VREG1.2 47.31,31.91 40.32,38.89 | C5.2 32.23,65.41 32.54,65.25 38.18,59.61 | 40.32,38.89 C8.- 40.01,44.13 | C102.2 42.86,87.15 47.62,82.39 47.62,74.45 50.01,72.07 VOLUME.1 | 23.5,31.59 VREG2.2 | 95.96,58.66 91.12,53.82 PORTA_CABINE.13 | 95.96,58.66 97.79,60.48 ULN1.9 97.95,68.9 99.54,70.48 99.54,89.38 89.22,99.69 | 89.22,99.69 COM1.3 | 95.96,58.66 103.82,50.8 RL_FIM_INFERIOR.13 108.9,50.8 110.81,52.7 117,52.7 118.59,51.12 RL_FIM_SUPERIOR.13 126.36,51.28 131.13,51.28 133.35,53.5 136.53,53.5 157.24,74.22 | 166.05,98.42 U$1.4 | 166.05,98.42 166.05,100.33 U$1.8 158.43,111.12 X1.8 | X1.4 158.43,91.28 165.74,98.58 166.05,98.42 | PORTA.2 139.54,109.54 158.12,90.96 X1.4 | S2.2 158.43,73.03 157.24,74.22 | 157.24,74.22 156.05,75.41 156.05,88.74 157.96,90.65 X1.4 | VOLUME.1 50.48,71.91 61.28,71.91 88.9,99.54 89.22,99.69 | 38.18,59.61 43.81,53.98 T2.E | 38.18,59.61 50.01,71.44 VOLUME.1 | VREG2.2 23.81,31.75 25.88,31.75 32.86,38.73 40.01,38.73 40.32,38.89
  pour Top (isolate 1.016): 0,120.02 180.02,120.02 180.02,37.47 61.59,37.47 61.59,0 0,0
  pour Bottom (isolate 1.016): 0,120.02 180.02,120.02 180.02,37.47 61.59,37.47 61.59,0 0,0
INF  (via drill 0.51)
  Top 0.406: R11.2 ULN1.7 | v163.51,99.38 U$1.6 | v91.92,74.14 91.92,98.9 85.09,105.73 85.09,111.44 88.58,114.94 144.78,114.94 158.43,101.28 X1.6
  Bottom 0.406: v163.51,99.38 160.18,99.38 158.43,101.12 X1.6 | R11.2 92.39,73.66 v91.92,74.14
N$1
  Top 2.032: SAIDA_CAN.2 166.05,7.94 D15.C 166.37,17.46 169.7,20.8 169.7,30 D4.C
N$2
  Bottom 2.032: D4.A D5.C 143.73,27.94 F1_CANCELAS.2
N$3
  Top 2.032: TRAFO_CAN.2 155.73,7.94 155.73,11.59 D15.A D6.C
N$4
  Top 2.032: SAIDA_CAN.1 161.13,7.94 161.13,17.3 D6.A D5.A
N$5  (1 unrouted)
  Top 0.813: 106.52,30.16 106.52,32.66 109.93,36.07 115.27,36.07 117.6,33.73 120.19,33.73 CTT-SOBE.1
  Bottom 0.762: PORTA_CABINE.4 98.74,48.74 104.3,43.18 104.3,35.51 104.3,32.23 106.36,30.16 CTT-DESCE.1
  Bottom 0.813: CTT-LIGA.1 71.5,33.5 74.45,36.45 88.01,36.45 89.2,35.26 | 89.2,35.26 104.05,35.26 104.3,35.51 | CTT-FREIO.1 88.96,35.01 89.2,35.26
N$6
  Top 0.406: R36.2 40.01,81.28 VOLUME.3
N$7
  Top 0.762: C8.+ 37.62,44.13 42.7,39.69 44.13,38.42 45.72,38.42 45.72,31.11 VREG1.1
  Bottom 0.762: VREG1.1 47.62,27.3 D12.C D11.C
N$9
  Bottom 2.032: 68.26,3.49 68.26,3.81 66.36,5.71 66.36,6.35 67.94,7.94
N$10
  Top 0.406: R10.1 84.77,80.64 FIM_SUPER..K
N$11
  Top 0.406: R26.2 45.09,81.92 VOLUME.2
N$13
  Bottom 2.032: 84.45,7.94 84.45,7.62 86.36,5.71
N$15
  Bottom 2.032: 86.04,5.71 86.04,4.76 84.45,3.17
N$16
  Bottom 2.032: 141.29,9.53 141.6,9.53 143.51,7.62
N$17
  Bottom 2.032: 146.05,9.84 143.83,7.62
N$18
  Bottom 2.032: 141.29,26.04 141.92,26.04 143.51,27.62 145.1,26.04 146.05,26.04
N$19
  Top 0.406: FIM_INFER..K R11.1
N$20
  Bottom 2.032: 57.47,3.49 57.15,3.49 55.24,5.4
N$21
  Top 0.406: T1.1 R1.1
N$22
  Bottom 2.032: 57.47,3.81 58.42,3.81 60.01,5.4
N$23
  Bottom 2.032: 57.78,23.5 56.83,23.5 54.93,21.59
N$24
  Top 0.406: PORTA_CABIN..K R12.1
N$25
  Bottom 2.032: 59.69,21.91 59.37,21.91 57.47,23.81
N$26
  Bottom 2.032: 28.26,5.4 30.16,3.49 30.8,3.49 33.02,5.71 33.34,5.71
N$27  (via drill 3.5 pad 6.45)
  other vias: 5.71,88.27
N$28
  Top 0.406: R13.1 118.11,87.63 SOBE.K
N$29
  Top 0.406: R14.1 121.28,83.82 DESCE.K
N$30  (via drill 3.5 pad 6.45)
  other vias: 5.71,56.52
N$31  (via drill 3.5 pad 6.45)
  other vias: 6.99,31.43
N$32
  Top 0.406: R15.1 119.38,81.28 FREIO.K
N$33
  Top 0.406: R16.1 118.11,75.56 LIGA.K
N$34  (via drill 3.5 pad 6.45)
  other vias: 31.43,31.75
N$35  (via drill 3.5 pad 7)
  other vias: 5,114
N$36  (via drill 3.5 pad 7)
  other vias: 174,59.5
N$37  (via drill 3.5 pad 7)
  other vias: 66.36,40.96
N$38  (via drill 3.5 pad 7)
  other vias: 5,5
N$39
  Top 0.406: T2.B 39.05,56.52 R50.1
N$40  (via drill 3.5 pad 7)
  other vias: 174,5
N$41  (via drill 3.5 pad 7)
  other vias: 84.06,94.4
N$42  (via drill 3.5 pad 7)
  other vias: 174,114
N$78
  Bottom 2.032: F1_CANCELAS.1 143.81,7.94 TRAFO_CAN.1
N$79
  Top 0.762: C1.+ R33.1
  Bottom 0.762: IC1.4 19.37,90.65 24.77,96.04 41.43,96.04 | R31.1 41.43,96.04 | R33.1 41.75,96.04 41.43,96.04
N$80
  Top 0.406: C4.- R26.1
N$89  (via drill 0.51)
  Top 0.406: R30.2 27.62,104.14 Q1000.C | C4.+ 24.13,79.38 v18.89,84.61
  Bottom 0.406: v18.89,84.61 17.62,85.88 17.62,96.52 21.59,100.49 25.88,100.49 R30.2
N$90  (via drill 0.51)
  Top 0.406: R29.2 30.16,104.14 33.02,107 | 33.02,107 R28.1 | 33.02,107 Q1000.B | v38.73,99.06 C10.+
  Bottom 0.406: v38.73,99.06 38.73,101.28 R28.1
N$92
  Top 0.406: R27.1 C1002.+ Q1000.E
N$94
  Top 0.406: C3.- R36.1
N$104
  Top 0.762: IC1.5 R30.1 R29.1 | C5.1 23.18,61.59 21.27,59.69 21.27,58.42 T1.2
  Bottom 0.762: IC1.5 23.18,90.65 21.27,88.74 21.27,67.31 C5.1
N$105
  Top 0.406: C3.+ IC1.1
N$106
  Top 0.762: R31.2 R32.1 42.55,102.08 40.8,100.33 23.5,100.33 C2.-
N$119
  Top 0.762: IC1.2 19.37,87.79 21.27,89.69 21.27,96.84 C2.+
N$120
  Top 0.406: R33.2 C102.1
NEG-DESCE
  Bottom 0.406: CTT-DESCE.2 118.27,30.16 118.27,35.72 D2.C 116.52,37.62 118.27,39.37 118.27,46.2 116.2,48.26 RL_FIM_INFERIOR.4
NEG-FREIO
  Top 0.406: CTT-FREIO.2 100.97,30.16 D1.A D2.A 109.55,37.47 114.71,42.62 120.57,42.62 D3.A
NEG-LIGA  (via drill 0.51)
  Top 0.406: R16.2 ULN1.14 | v105.25,63.34 105.25,60.8 104.46,60.01 104.46,44.13 95.73,35.4 88.74,35.4 83.5,30.16 CTT-LIGA.2
  Bottom 0.406: ULN1.14 103.82,77.15 103.82,64.77 v105.25,63.34
NEG-SOB
  Bottom 0.406: CTT-SOBE.2 135.89,30.16 D3.C 135.89,46.35 133.67,48.58 RL_FIM_SUPERIOR.4
OPT_AUDIO_FALA
  Top 0.406: ULN1.1 97.79,100.01 103.19,105.41 103.19,108.58 COM1.16
OPT_AUDIO_LIGA  (via drill 0.51)
  Top 0.406: COM1.14 101.92,110.49 103.98,112.55 112.08,112.55 v112.39,112.24
  Bottom 0.406: v112.39,112.24 111.76,112.24 108.74,115.25 65.72,115.25 62.07,111.6 62.07,103.98 48.26,90.17 42.39,90.17 34.77,82.55 34.77,73.98 26.35,65.88 R50.2
OPT_DESCE
  Top 0.406: ULN1.3 95.41,86.2 95.41,105.25 95.57,105.41 95.57,108.58 COM1.10
OPT_FIM_INFERIOR  (via drill 0.51)
  Top 0.406: v100.65,96.84 100.65,71.44 v102.39,69.69 | R6.1 v105.73,59.69
  Bottom 0.406: COM1.7 95.09,107.31 96.36,108.58 99.85,108.58 100.65,107.79 v100.65,96.84 | v102.39,69.69 102.39,64.61 105.73,61.28 v105.73,59.69
OPT_FIM_SUPERIOR  (via drill 0.51)
  Top 0.406: v116.2,79.69 116.2,63.18 v117.63,61.75
  Bottom 0.406: COM1.9 96.84,106.68 94.77,104.62 93.82,104.62 93.03,105.41 93.03,111.76 93.82,112.55 102.39,112.55 103.19,111.76 103.19,93.66 116.2,80.64 v116.2,79.69 | R3.1 v117.63,61.75
OPT_FREIO
  Top 0.406: ULN1.4 94.61,84.45 94.61,103.82 93.03,105.41 93.03,108.58 COM1.8
OPT_LIGA
  Top 0.406: ULN1.5 93.82,82.71 93.82,102.08 90.49,105.41 90.49,108.58 COM1.6
OPT_PANTOGRAFICA  (via drill 0.51)
  Top 0.406: v99.38,98.11 99.38,68.1 93.98,62.71 v92.55,62.71
  Bottom 0.406: v99.38,98.11 COM1.11 | v92.55,62.71 88.27,58.42 R23.1
OPT_SENSOR1
  Bottom 0.406: COM1.5 91.76,108.11 90.49,109.38 90.49,111.76 92.08,113.35 104.14,113.35 105.73,111.76 105.73,105.41 124.14,87 125.89,87 142.56,70.33 R9.1
OPT_SENSOR2
  Top 0.406: COM1.13 101.92,108.11 100.65,109.38 100.65,111.76 102.23,113.35 121.28,113.35 135.41,99.22 160.18,99.22 165.42,104.46 170.02,104.46 173.04,101.44 173.04,84.77 142.56,54.29 R24.1
OPT_SENSOR3  (via drill 0.51)
  Top 0.406: v135.73,54.77 135.73,48.74 R25.1
  Bottom 0.406: COM1.15 104.46,102.23 120.49,86.2 120.49,76.83 124.3,73.03 125.89,73.03 135.73,63.18 v135.73,54.77
OPT_SOBE
  Top 0.406: ULN1.2 96.2,87.95 96.2,103.5 98.11,105.41 98.11,108.58 COM1.12
PANTOGRAFICA
  Top 0.406: PORTA_CABINE.11 R23.2
PORTA_CABINE
  Top 0.406: ULN1.8 95.25,71.12 R12.2 95.09,71.12 93.03,73.18 93.03,100.33 87.95,105.41 87.95,111.76 90.33,114.14 138.43,114.14 143.03,109.54 PORTA.1
RELE_FALAR
  Bottom 0.406: ULN1.18 105.41,90.49 90.49,105.41 90.49,107.79 89.69,108.58 76.83,108.58 RELE_IN_AUDIO.1
RELE_LIGA_AUDIO
  Top 0.406: R1.2 T2.C
RL_INF
  Bottom 0.406: ULN1.12 108.58,70.48 RL_FIM_INFERIOR.16
RL_PT_CABINE
  Top 0.406: ULN1.11 93.03,58.74 PORTA_CABINE.16
RL_SUP
  Bottom 0.406: ULN1.13 108.58,76.2 RL_FIM_SUPERIOR.16
RS485-A  (via drill 0.51)
  Top 0.406: 157.4,82.31 158.43,81.28 X1.2 | 157.4,82.31 v154.78,84.93 | U$1.2 167.64,92.55 157.4,82.31
  Bottom 0.406: COM1.17 107,106.68 119.54,94.14 145.57,94.14 v154.78,84.93
RS485-B  (via drill 0.51)
  Top 0.406: 157.4,77.23 158.43,76.2 X1.1 | 157.4,77.23 v139.38,95.25 | U$1.1 170.18,90.01 157.4,77.23
  Bottom 0.406: COM1.19 127.32,107.31 v139.38,95.25
SAIDA-AUDIO
  Top 0.762: 53.66,111.12 53.98,111.12 RELE_IN_AUDIO.9 | 53.66,111.12 C1.- | RELE_IN_AUDIO.6 53.66,110.81 53.66,111.12
SAIDA_FUSIVEL
  Top 0.762: V1000.2 36.83,9.84 D11.A 40.01,12.86 42.23,15.08 48.58,15.08 50.32,13.34 D14.C 57.47,20 57.47,23.5 FUSIVEL_GERAL.2
SAIDA_FUSIVEL1
  Bottom 0.762: V101.2 16.83,12.38 D8.A D9.C 20.48,13.02 22.07,14.61 23.97,14.61 30.8,21.43 30.8,23.5 FUSIVEL_GERAL1.2
  Bottom 2.032: 28.26,21.91 29.21,21.91 30.8,23.5 31.43,23.5 33.34,21.59
SENSOR1
  Top 0.406: R9.2 158.43,62.23 S2.1
SENSOR2
  Top 0.406: R24.2 158.43,52.07 S3.1
SENSOR3
  Top 0.406: R25.2 158.43,41.91 S4.1
SOB-DESC-PROT
  Top 2.032: CTT-DESCE.P 112.39,29.69 116.48,25.6 125.78,25.6 129.79,29.62 129.79,32 CTT-SOBE.P
SUP  (via drill 0.51)
  Top 0.406: R10.2 ULN1.6 | v103.03,41.12 106.52,41.12 109.06,43.66 116.68,43.66 124.3,51.28 124.3,51.91 129.38,56.99 134.46,56.99 138.27,60.8 138.27,95.73 138.91,96.36 148.27,96.36 158.43,86.2 X1.3
  Bottom 0.406: U$1.3 171.61,94.14 171.61,91.92 165.89,86.2 158.43,86.2 X1.3 | R10.2 92.39,76.2 87,70.8 87,52.7 96.68,43.02 101.12,43.02 v103.03,41.12
(copper drawn outside any net)
  shapes: Top area x4

### Text on the board
tPlace: COMUM | AUDIO_TORRE | INF-FIM | +12V | ACESSO REPRESENTA / ACIONADO | GND | SUP-FIM | A | B | ACESSO REPRESENTA / ABERTO | COMUM | SENSOR1 | COMUM | SENSOR2 | COMUM | SENSOR3 | JUMPER EM CASO DE NÃO USO
200bmp: C:/Users/Alex/Desktop/PATA.bmp